# Altium schematic sheet Regulador.SchDoc
size A
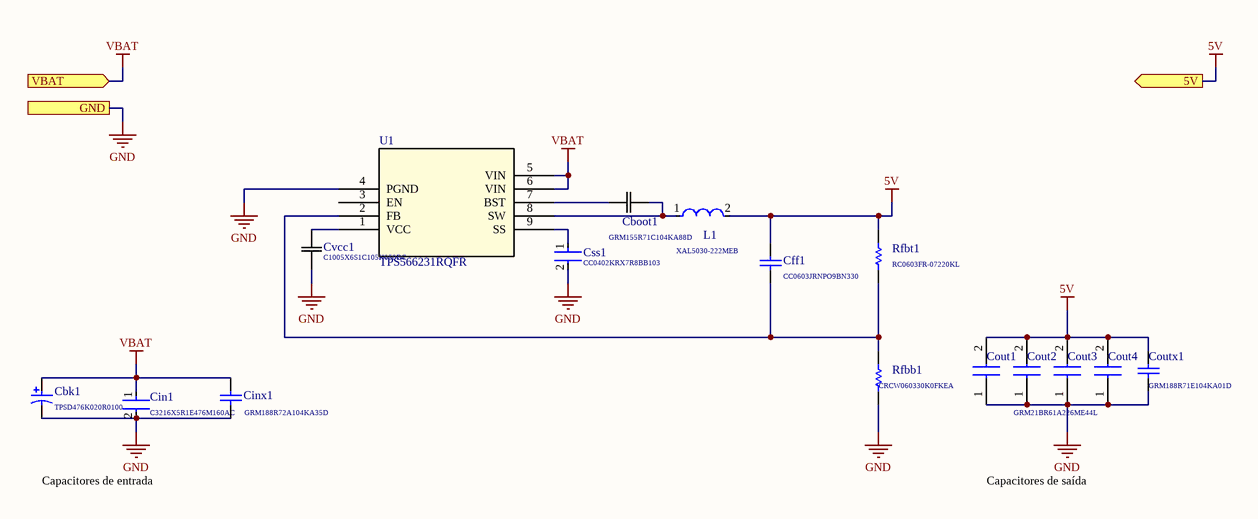
[diagram p0: Regulador.SchDoc]

## Parts
Cbk1  TPSD476K020R0100  [TPSD476K020R0100]
Cboot1  GRM155R71C104KA88D  [CAP_GRM_155_MUR]
Cff1  CC0603JRNPO9BN330  [CAPC1608X90X40LL10T20]
Cin1  C3216X5R1E476M160AC  [FP-C3216-160-MFG]
Cinx1  GRM188R72A104KA35D  [CAPC1608X90X35NL10T15]
Cout1  GRM21BR61A226ME44L  [CAPC2012X145N]
Cout2  GRM21BR61A226ME44L  [CAPC2012X145N]  (value not drawn)
Cout3  GRM21BR61A226ME44L  [CAPC2012X145N]  (value not drawn)
Cout4  GRM21BR61A226ME44L  [CAPC2012X145N]  (value not drawn)
Coutx1  GRM188R71E104KA01D  [CAPC1608X90X35LL10T15]
Css1  CC0402KRX7R8BB103  [FP-CC0402-MFG]
Cvcc1  C1005X6S1C105K050BC  [CAP_1005_TDK]
L1  XAL5030-222MEB  [FP-XAL5030-222MEB-MFG]
Rfbb1  CRCW060330K0FKEA  [RESC1609X50X30LL10T20]
Rfbt1  RC0603FR-07220KL  [RESC1608X55X25ML10T15]
U1  TPS566231RQFR  [QFN_231RQFR_TEX]

## Ports
5V (out), GND, VBAT (in)

## Nets
5V: Cff1.2 Cout1.2 Cout2.2 Cout3.2 Cout4.2 Coutx1.2 L1.2 Rfbt1.2 ; port 5V
GND: Cbk1.2 Cin1.2 Cinx1.1 Cout1.1 Cout2.1 Cout3.1 Cout4.1 Coutx1.1 Css1.2 Cvcc1.2 Rfbb1.1 U1.4(PGND) ; port GND
VBAT: Cbk1.1 Cin1.1 Cinx1.2 U1.5(VIN) U1.6(VIN) ; port VBAT
NetCboot1_1: Cboot1.1 L1.1 U1.8(SW)
NetCboot1_2: Cboot1.2 U1.7(BST)
NetCff1_1: Cff1.1 Rfbb1.2 Rfbt1.1 U1.2(FB)
NetCss1_1: Css1.1 U1.9(SS)
NetCvcc1_1: Cvcc1.1 U1.1(VCC)

Not connected (* = marked no-connect by the designer): U1 3(EN)

## Notes on the sheet
- Capacitores de entrada
- Capacitores de saída

## Library data of the parts
Cbk1 = TPSD476K020R0100: CAP TANT 47UF 20V 10% 2917; Manufacturer: Kyocera AVX; Dielectric Material: Tantalum; ESR (Equivalent Series Resistance): 100mR; Leakage Current: 9.4uA; Polarity: Polar; Dissipation Factor: 6%; Ripple Current: 490uA; Supplier 1: Arrow Electronics; Manufacturer Part Number: TPSD476K020R0100; RoHS: Yes; Category: Tantalum Capacitors; Stock 1: 2; Pricing 1: 1=1.88550, 10=1.55250, 25=1.53920, 50=1.52390, 100=1.08810, 1000=1.02300 (USD); Mount: Surface Mount; Case/Package: 2917; Weight: 0.023634oz; Case Code (Imperial): 2917; Case Code (Metric): 7343; Min Operating Temperature: -55°C; Max Operating Temperature: 125°C; Capacitance: 47uF; Tolerance: 10%; Termination: SMD/SMT; Voltage: 20V; Features: General Purpose; Packaging: Tape and Reel; Voltage Rating: 20V; Package Quantity: 1; Length: 7.3mm; Height: 2.9mm; Depth: 4.3mm; Height - Seated (Max): 0.122inch; Width: 4.3mm; Radiation Hardening: No; REACH SVHC: No SVHC; Lead Free: Lead Free; ComponentLink1URL: https://datasheet.ciiva.com/11794/0900766b80962b61-11794592.pdf?src-supplier=RSComponents; ComponentLink1Description: https://datasheet.ciiva.com/11794/0900766b80962b61-11794592.pdf?src-supplier=RSComponents; ComponentLink2URL: https://datasheet.ciiva.com/39121/1154520-39121511.pdf?src-supplier=Jameco; ComponentLink2Description: https://datasheet.ciiva.com/39121/1154520-39121511.pdf?src-supplier=Jameco; ComponentLink3URL: https://datasheet.ciiva.com/26787/tpsd476k020r0100-26787068.pdf?src-supplier=IIIC; ComponentLink3Description: https://datasheet.ciiva.com/26787/tpsd476k020r0100-26787068.pdf?src-supplier=IIIC; ComponentLink4URL: https://datasheet.ciiva.com/7713/1680477-7713477.pdf?src-supplier=Element14; ComponentLink4Description: https://datasheet.ciiva.com/7713/1680477-7713477.pdf?src-supplier=Element14; ComponentLink5URL: https://datasheet.ciiva.com/7713/1680477-7713478.pdf?src-supplier=Element14; ComponentLink5Description: https://datasheet.ciiva.com/7713/1680477-7713478.pdf?src-supplier=Element14; ComponentLink6URL: https://datasheet.ciiva.com/16632/tps-16632569.pdf?src-supplier=Avnet+Europe; ComponentLink6Description: https://datasheet.ciiva.com/16632/tps-16632569.pdf?src-supplier=Avnet+Europe; ComponentLink7URL: https://datasheet.ciiva.com/12910/tps-23028-12910555.pdf?src-supplier=Mouser; ComponentLink7Description: https://datasheet.ciiva.com/12910/tps-23028-12910555.pdf?src-supplier=Mouser; ComponentLink8URL: https://datasheet.ciiva.com/11232/tps-11232172.pdf?src-supplier=Avnet; ComponentLink8Description: https://datasheet.ciiva.com/11232/tps-11232172.pdf?src-supplier=Avnet; ComponentLink9URL: https://datasheet.ciiva.com/265/tps-265005.pdf?src-supplier=Digi-Key; ComponentLink9Description: https://datasheet.ciiva.com/265/tps-265005.pdf?src-supplier=Digi-Key; ComponentLink10URL: https://datasheet.ciiva.com/265/tps-265006.pdf?src-supplier=Digi-Key; ComponentLink10Description: https://datasheet.ciiva.com/265/tps-265006.pdf?src-supplier=Digi-Key; ComponentLink11URL: https://datasheet.ciiva.com/265/tps-265007.pdf?src-supplier=Digi-Key; ComponentLink11Description: https://datasheet.ciiva.com/265/tps-265007.pdf?src-supplier=Digi-Key
Cboot1 = GRM155R71C104KA8: CAP CER .1UF 16V X7R 0402; Vendor: Murata; Capacitance: 0.1ÂµF; Tolerance: Unknown; Operating_Temperature: -55Â°C ~ 125Â°C; Mounting_Type: Surface Mount, MLCC; HEADER_SECTION: Passives; HEADER_GROUP: Capacitors; R-S_Number: 6242317; Value: Unknown; SourceLibrary: Murata_2014-12-31; DigiKeyPartNumber: 490-3261-1-ND; Manufacturer_Part_Number: GRM155R71C104KA88D; Quantity_Available: 0; DataSheet: http://search.murata.co.jp/Ceramy/image/img/PDF/ENG/GRM155R71C104KA88.pdf; Voltage_-_Rated: 16V; Package_/_Case: 0402 (1005 metric); Temperature_Coefficient: X7R; Packaging: Cut Tape (CT); Features: General Purpose; Lead_Spacing: -; Thickness: 0.50mm; Manufacturer_Name: Murata; Mounting: Surface Mount; Voltage: Unknown; Package/Case: 0402; Current_Rating: Unknown; Copyright: Copyright (C) 2015 Accelerated Designs. All rights reserved; RefDes: RefDes; Type: DEV
Cff1 = CMP-2000-06072-1: Chip Capacitor, 33 pF, +/- 5%, 50 V, -55 to 125 degC, 0603 (1608 Metric), RoHS, Tape and Reel; Manufacturer: Yageo; Product Training Modules: MultilayerCeramicCapacitors; Voltage - Rated: 50V; Capacitance: 33pF; Featured Product: CommodityMultilayerCeramicCapacitors–CCSeries; Other Names: 0603CG330J9B200223886715339223886715339311-1064-2311-1282-2311-1282-2-NDCC0603JRNP09BN330BCC0603JRNPO9BN330B; Online Catalog: CCSeries; Temperature Coefficient: C0G,NP0; Operating Temperature: -55°C~125°C; Thickness (Max): 0.035"(0.90mm); Size / Dimension: 0.063"Lx0.031"W(1.60mmx0.80mm); Lead Spacing: -; Mounting Type: SurfaceMount,MLCC; Tolerance: ±5%; Standard Package: 4,000; Mounting Technology: SurfaceMount; Ratings: -; Applications: GeneralPurpose; Height - Seated (Max): -; Packaging: Tape&Reel(TR); Series: CC; Package / Case: 0603(1608Metric); Package Description: 2-Pin Surface Mount Device, Body 1.6 x 0.8 mm; Manufacturer URL: http://www.yageo.com/; Family: CeramicCapacitors; Package Reference: 0603; Category: Capacitors; Datasheet Version: Rev. 14, 07/2016; Datasheet URL: http://www.yageo.com/NewPortal/yageodocoutput?fileName=/pdf/MLCC/UPY-GP_NP0_16V-to-50V_14.pdf; Features: -; Lead Style: -
Cin1 = CMP-08246-000014-1: CAP CER 47UF 25V X5R 1206; 3DS Part Number: 220-00004; Manufacturer: TDK; Temperature Coefficient: 15%; Tolerance: 20%; Height: 1.8mm; Device Class L1: Passive Components; Temperature Characteristic: X5R; Voltage: 25V; Digikey Description: CAP CER 47UF 25V X5R 1206; Voltage Rating: 25V; ComponentLink2URL: https://product.tdk.com/info/en/catalog/datasheets/mlcc_commercial_general_en.pdf; Category: Cap; Capacitance: 47uF; Ipc Land Pattern Name: CAPC320160X160; Temperature Range High: +85°C; ComponentLink2Description: Datasheet; Temperature: -55°C to +85°C; Mouser Description: Multilayer Ceramic Capacitors MLCC - SMD/SMT 1206 47uF 25volts X5R 20%; Lead Free: Yes; RoHS: TRUE; Device Class L2: Capacitors; Device Class L3: Ceramic Capacitors; Manufacturer Part Number: C3216X5R1E476M160AC; Automotive: No; Temperature Range Low: -55°C; Footprint Url: https://product.tdk.com/info/en/catalog/spec/mlccspec_commercial_general_midvoltage_en.pdf; Material: Ceramic; Value: 47uF; Octopart: https://octopart.com/c3216x5r1e476m160ac-tdk-25947783; Package: C3216-160
Cinx1 = CMP-1662-00005-4: Chip Capacitor, 0.1 uF, +/- 10%, 100 V, 0603 (1608 Metric), RoHS, Tape and Reel; Manufacturer: Murata; Voltage Rating: 100 V; Max Operating Temperature: 125 degC; Package Quantity: 4000; Packaging: Tape and Reel; Length: 1.6 mm; DatasheetVersion: 02/2016; ComponentLink2URL: http://search.murata.co.jp/Ceramy/image/img/A01X/G101/ENG/GRM188R72A104KA35-01.pdf; ComponentLink1Description: Manufacturer URL; Height: 0.8 mm; REACH SVHC: No SVHC; Mounting Technology: Surface Mount; Min Operating Temperature: -55 degC; ComponentLink2Description: Datasheet; PackageReference: 0603; ComponentLink1URL: http://www.murata.com/; RoHSCompliant: true; PackageDescription: 2-Pin Surface Mount Device, Body 1.6 x 0.8 mm; Mount: Surface Mount
Cout1-Cout4 = GRM21BR61A226ME44L: Capacitor; Manufacturer_Name: Murata Electronics; Datasheet Link: http://www.murata.com/~/media/webrenewal/support/library/catalog/products/capacitor/mlcc/c02e.pdf; Height: 1.45mm; Manufacturer_Part_Number: GRM21BR61A226ME44L; Arrow Part Number: GRM21BR61A226ME44L; Arrow Price/Stock: https://www.arrow.com/en/products/grm21br61a226me44l/murata-manufacturing; Mouser Part Number: 81-GRM21BR61A226ME4L; Mouser Price/Stock: https://www.mouser.co.uk/ProductDetail/Murata-Electronics/GRM21BR61A226ME44L?qs=eeBpzGFlv%252B8tSfxib2AMhw%3D%3D
Coutx1 = CMP-2006-02868-1: Manufacturer: Murata; Part Number: GRM188R71E104KA01D
Css1 = CMP-03422-000595-1: CAP CER 10000PF 25V X7R 0402; Manufacturer: YAGEO; Automotive Grade: NA; Value: 10 nF; Temperature Coefficient: 30ppm/°C; Tolerance: 0.1; Digikey Description: CAP CER 10000PF 25V X7R 0402; Temperature: -55°C to +125°C; Temperature Range Low: -55°C; Ipc Land Pattern Name: CAPC10050X50; ComponentLink2Description: Datasheet; Temperature Characteristic: X7R; Material: Ceramic; Category: Cap; Footprint Url: http://www.yageo.com/exep/pages/download/literatures/UPY-C_GEN_24.pdf; Manufacturer Part Number: CC0402KRX7R8BB103; ComponentLink2URL: http://www.yageo.com/documents/recent/UPY-GP_NP0_16V-to-50V_16.pdf; Device Class L2: Capacitors; Octopart: https://octopart.com/cc0402krx7r8bb103-yageo-8376512; RoHS: TRUE; Device Class L1: Passive Components; Voltage Rating: 25 V; Mouser Description: Multilayer Ceramic Capacitors MLCC - SMD/SMT 10nF 25V X7R 10%; Automotive: No; Package: CC0402; Lead Free: Yes; Device Class L3: Ceramic Capacitors; Height: 0.55mm; Temperature Range High: +125°C; Capacitance: 10 nF
Cvcc1 = C1005X6S1C105K05: No Description Available; Vendor: TDK; Built_By: EMA_UL_Team; SourceLibrary: TDK_2015_05_22; Manufacturer_Part_Number: C1005X6S1C105K050BC; Copyright: Copyright (C) 2018 Accelerated Designs. All rights reserved; RefDes: RefDes; Type: DEV
L1 = CMP-11268-000050-1: Fixed Inductors 2.2uH 20% 9.7A 14.5mOhms; DC Resistance (DCR): 14.5mR; Shielding: Shielded; Max DC Current: 9.2A; Test Frequency: 100kHz; Self Resonant Frequency: 38MHz; Core Material: Composite; Lead Free: Contains Lead; Inductance: 2.2uH; Max Operating Temperature: 125°C; Termination: SMD/SMT; Min Operating Temperature: -40°C; Height: 3.1mm; Package Quantity: 20; Packaging: Tape and Reel; Tolerance: 20%; Length: 5.68mm; Width: 5.48mm
Rfbb1 = CMP-2000-03223-1: Manufacturer: Vishay Dale; Part Number: CRCW060330K0FKEA
Rfbt1 = CMP-1659-00037-1: Chip Resistor, 220 KOhm, +/- 1%, 100 mW, -55 to 155 degC, 0603 (1608 Metric), RoHS, Tape and Reel; Resistance: 0.1 Ohm; ComponentLink1Description: Manufacturer URL; ComponentLink2Description: Datasheet; ComponentLink1URL: http://www.yageo.com/; REACH SVHC: No SVHC; RoHSCompliant: true; DatasheetVersion: Rev. 4, 02/2016; Min Operating Temperature: -25 degC; Height: 0.25 inch; ComponentLink2URL: http://www.yageo.com/documents/recent/PYu-RC_Group_51_RoHS_L_04.pdf; PackageDescription: 2-Pin Surface Mount Device, Body 1.6 x 0.8 mm; Max Operating Temperature: 70 degC; Width: 0.25 inch; Length: 0.75 inch; PackageReference: 0603
U1 = TPS566231RQFR: No Description Available; Built_By: EMA_Matt; Vendor: Texas Instruments; SourceLibrary: TI_2020-07-16; Datasheet: https://www.ti.com.cn/cn/lit/ds/symlink/tps566238.pdf?ts=1594414902944&ref_url=https%253A%252F%252Fwww.google.com%252F; Copyright: Copyright (C) 2018 Accelerated Designs. All rights reserved; Manufacturer_Part_Number: TPS566231RQFR; RefDes: RefDes; Type: DEV